# EAGLE design capSwitch (EAGLE 7.1.0)
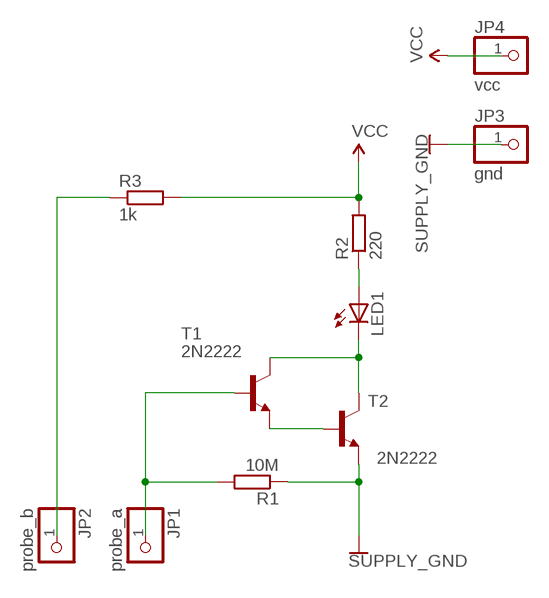
[diagram p0: schematic, sheet 1]

## Parts
JP1  probe_a  HEADER-1X1  [1X01_OVAL]
JP2  probe_b  HEADER-1X1  [1X01_OVAL]
JP3  gnd  HEADER-1X1  [1X01_OVAL]
JP4  vcc  HEADER-1X1  [1X01_OVAL]
LED1  LED5MM  [LED5MM]
R1  10M  RESISTOR-PTH-0.4  [RTH025W]
R2  220  RESISTOR-PTH-0.4  [RTH025W]
R3  1k  RESISTOR-PTH-0.4  [RTH025W]
T1  2N2222  [TO92-EBC-OVAL]
T2  2N2222  [TO92-EBC-OVAL]

## Nets
GND: JP3.1 R1.1 T2.E ; supply symbol labelled SUPPLY_GND
N$1: LED1.A R2.1
N$2: LED1.K(C) T1.C T2.C
N$3: JP2.1 R3.1
N$4: JP1.1 R1.2 T1.B
N$6: T1.E T2.B
VCC: JP4.1 R2.2 R3.2

## Library data of the parts
JP1-JP4 = microbuilder:HEADER-1X1: PIN HEADER
LED1 = adafruit:LED: LED OSRAM: - CHIPLED LG R971, LG N971, LY N971, LG Q971, LY Q971, LO R971, LY R971 LH N974, LH R974 LS Q976, LO Q976, LY Q976 LO Q996 - Hyper CHIPLED LW Q18S LB Q993, LB Q99A, LB R99A - SideLED LS A670, LO A670, LY A670, LG A670, LP A670 LB A673, LV A673, LT A673, LW A673 LH A674 LY A675 LS A676, LA A676, LO A676, LY A676, LW A676 LS A679, LY A679, LG A679 - Hyper Micro SIDELED® LS Y876, LA Y876, LO Y876, LY Y876 LT Y87S - SmartLED LW L88C, LW L88S LB L89C, LB L89S, LG L890 LS L89K, LO L89K, LY L89K LS L896, LA L896, LO L896, LY L896 - TOPLED LS T670, LO T670, LY T670, LG T670, LP T670 LSG T670, LSP T670, LSY T670, LOP T670, LYG T670 LG T671, LOG T671, LSG T671 LB T673, LV T673, LT T673, LW T673 LH T674 LS T676, LA T676, LO T676, LY T676, LB T676, LH T676, LSB T676, LW T676 LB T67C, LV T67C, LT T67C, LS T67K, LO T67K, LY T67K, LW E67C LS E67B, LA E67B, LO E67B, LY E67B, LB E67C, LV E67C, LT E67C LW T67C LS T679, LY T679, LG T679 LS T770, LO T770, LY T770, LG T770, LP T770 LB T773, LV T773, LT T773, LW T773 LH T774 LS E675, LA E675, LY E675, LS T675 LS T776, LA T776, LO T776, LY T776, LB T776 LHGB T686 LT T68C, LB T68C - Hyper Mini TOPLED® LB M676 - Mini TOPLED Santana® LG M470 LS M47K, LO M47K, LY M47K Source: http://www.osram.convergy.de/
R1-R3 = dp_devices:RESISTOR
T1 T2 = adafruit:2N2222: NPN TRANSISTOR Big oval pads

## Board
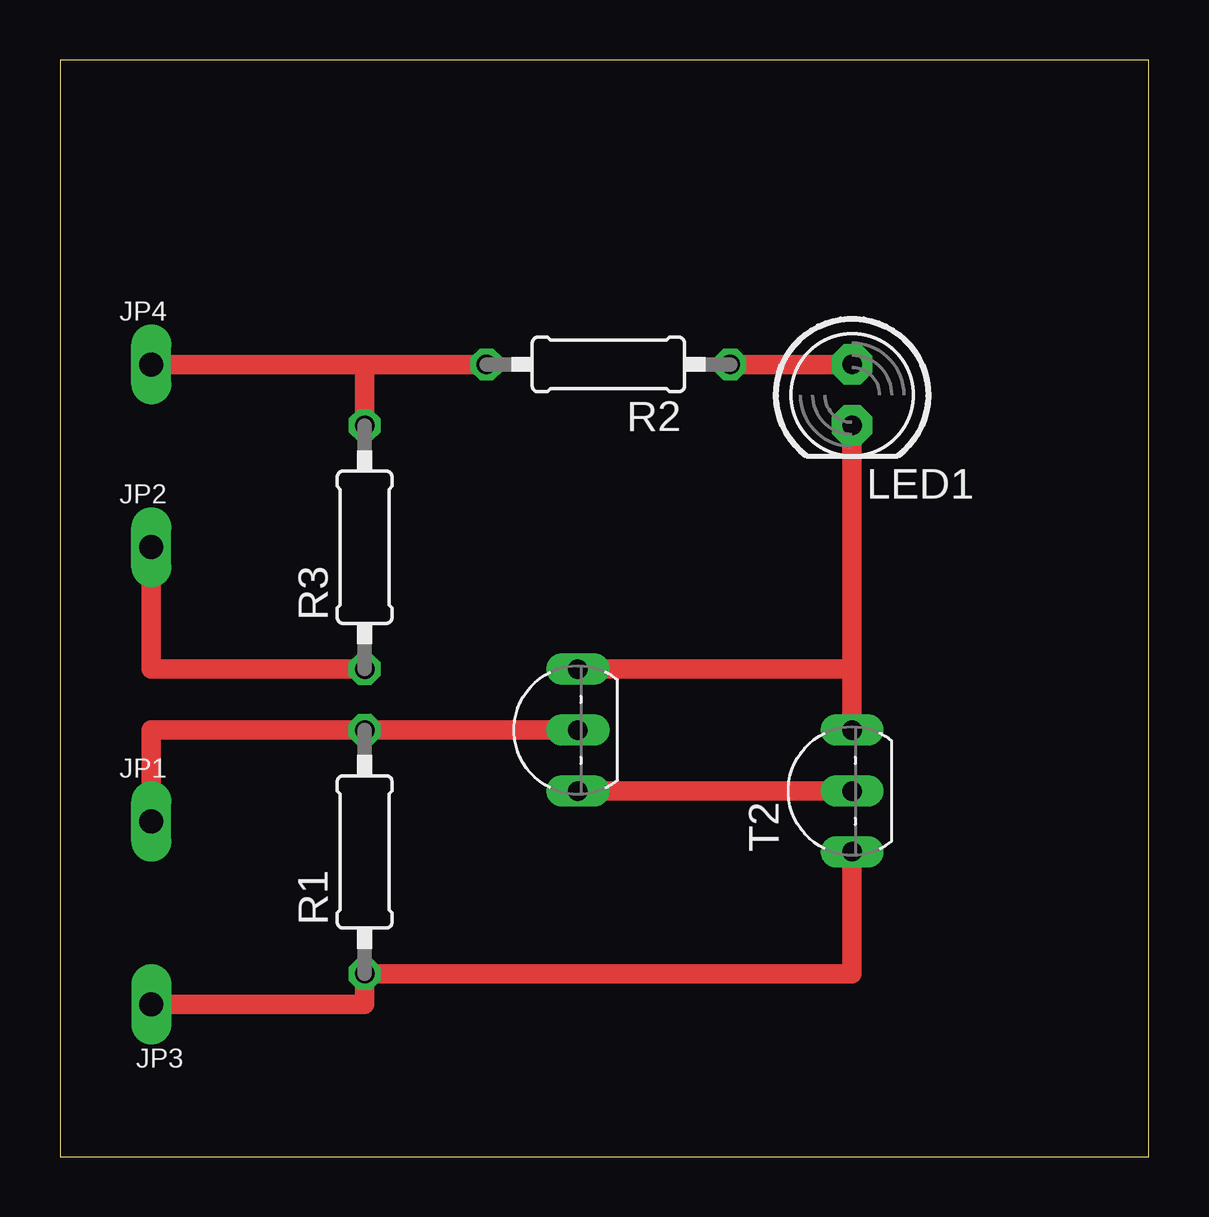
[diagram p1: board, top side]

Size 45.39 x 45.71 mm. Coordinates in mm from the lower left corner, seen from the top.
Outline: 0,0 45.39,0 45.39,45.71 0,45.71 0,0
Copper layers (1*16): Top 0.035mm / dielectric 1.5mm / Bottom 0.035mm
Design rules "default": minimum track width 10mil, minimum drill 0.6mm, track to track 8mil, track to pad 8mil, pad to pad 8mil, via to via 8mil, smd to smd 8mil, copper to edge 40mil, drill to drill 8mil, minimum pad ring 10mil, minimum via ring 8mil, stop-mask expansion 4mil, vias tented up to drill 0mil, thermal gap 10mil

### Footprints (pad centres in the part's own frame; a part is rotated, then mirrored left to right if it is on the bottom)
1X01_OVAL = drill 1 pad 1.676 long: 1 0,0
LED5MM = drill 0.813 pad 1.676 octagon: A -1.27,0; K 1.27,0
RTH025W = drill 0.813 octagon: 1 -5.08,0; 2 5.08,0
TO92-EBC-OVAL = drill 0.813 long: B 0,-1.27; C 2.54,-1.27; E -2.54,-1.27

### Placement (x,y rotation side)
JP1  3.81,13.97 0 top
JP2  3.81,25.4 0 top
JP3  3.81,6.35 180 top
JP4  3.81,33.02 0 top
LED1  33.02,31.75 270 top
R1  12.7,12.7 90 top
R2  22.86,33.02 180 top
R3  12.7,25.4 90 top
T1  20.32,17.78 90 top
T2  31.75,15.24 90 top

### Tracks (layer width: path | path; a pad name or v marks a point on that pad's centre or on a via)
GND
  Top 0.813: T2.E 33.02,7.62 R1.1 12.7,6.35 JP3.1
N$1
  Top 0.813: LED1.A R2.1
N$2
  Top 0.813: T1.C 33.02,20.32 T2.C LED1.K
N$3
  Top 0.813: R3.1 3.81,20.32 JP2.1
N$4
  Top 0.813: T1.B R1.2 3.81,17.78 JP1.1
N$6
  Top 0.813: T2.B T1.E
VCC
  Top 0.813: JP4.1 R2.2 12.7,33.02 R3.2